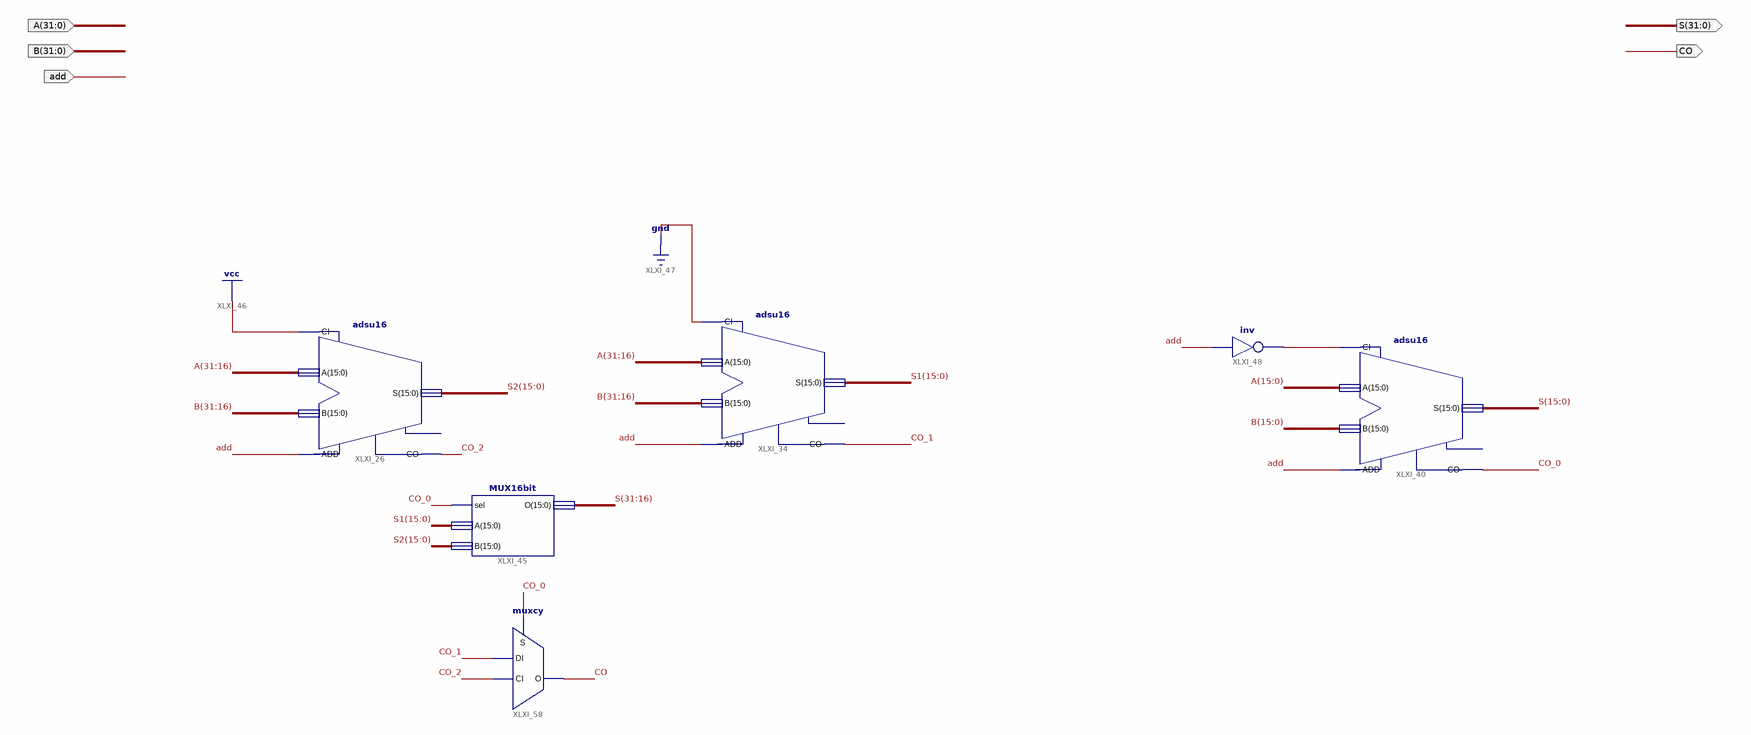
[diagram p0: schematic sheet 1]
// Xilinx ISE schematic ADD_SUB_32.sch (spartan6) as structural Verilog: 6 symbols, 5 ports
module ADD_SUB_32 (
  input  add,
  input  [31:0] A,
  input  [31:0] B,
  output CO,
  output [31:0] S
);

  wire CO_0, CO_1, CO_2, XLXN_144;
  wire [15:0] S1, S2;

  adsu16 XLXI_40 (.A(A[15:0]), .ADD(add), .B(B[15:0]), .CI(XLXN_144), .CO(CO_0), .S(S[15:0]));  // open: OFL
  adsu16 XLXI_26 (.A(A[31:16]), .ADD(add), .B(B[31:16]), .CI(1'b1), .CO(CO_2), .S(S2));  // open: OFL
  adsu16 XLXI_34 (.A(A[31:16]), .ADD(add), .B(B[31:16]), .CI(1'b0), .CO(CO_1), .S(S1));  // open: OFL
  MUX16bit XLXI_45 (.sel(CO_0), .A(S1), .B(S2), .O(S[31:16]));
  not XLXI_48 (XLXN_144, add);
  muxcy XLXI_58 (.CI(CO_2), .DI(CO_1), .S(CO_0), .O(CO));
endmodule
